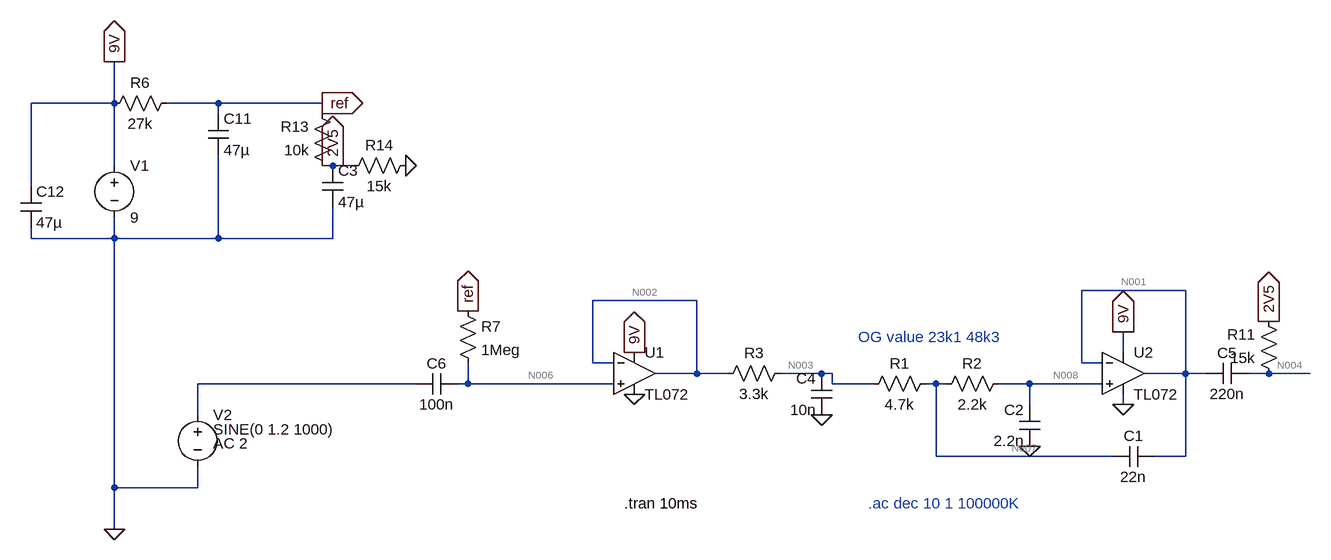
[diagram p0: schematic Butterworth_input_filter_breadboard.asc]
* Butterworth_input_filter_breadboard.asc
V1 9V 0 9
V2 N005 0 SINE(0 1.2 1000) AC 2
R1 N007 N003 4.7k
R2 N008 N007 2.2k
C1 N001 N007 22n
C2 0 N008 2.2n
C6 N006 N005 100n
R7 ref N006 1Meg
* U1: TL072 (symbol TL072 not available, pins judged from their places): In+=N006 In-=N002 V+=9V V-=0 OUT=N002
* U2: TL072 (symbol TL072 not available, pins judged from their places): In+=N008 In-=N001 V+=9V V-=0 OUT=N001
R11 N004 2V5 15k
R6 ref 9V 27k
R13 2V5 ref 10k
R14 2V5 0 15k
C11 ref 0 47µ
C12 9V 0 47µ
C3 2V5 0 47µ
R3 N003 N002 3.3k
C4 0 N003 10n
C5 N001 N004 220n
* .ac dec 10 1 100000K
* OG value 23k1 48k3
.tran 10ms
.backanno
.end

* Results of the author's LTspice run, read from the files saved beside the schematic
* Operating Point, zero values left out:
*   V(9v) = 9 V
*   V(n007) = 4.327 V
*   V(n003) = 4.327 V
*   V(n008) = 4.327 V
*   V(n001) = 4.327 V
*   V(n006) = 4.327 V
*   V(ref) = 4.327 V
*   V(n002) = 4.327 V
*   V(n004) = 2.596 V
*   V(2v5) = 2.596 V
*   I(R1) = -34.38 pA
*   I(R2) = -34.38 pA
*   I(R7) = 34.38 pA
*   I(R6) = -173.1 µA
*   I(R13) = -173.1 µA
*   I(R14) = 173.1 µA
*   I(R3) = -34.38 pA
*   I(V1) = -8.963 mA
*   Ix(u1:1) = 34.38 pA
*   Ix(u1:2) = 34.38 pA
*   Ix(u1:3) = 4.395 mA
*   Ix(u1:4) = -4.395 mA
*   Ix(u1:5) = -68.76 pA
*   Ix(u2:1) = 34.38 pA
*   Ix(u2:2) = 34.38 pA
*   Ix(u2:3) = 4.395 mA
*   Ix(u2:4) = -4.395 mA
*   Ix(u2:5) = -34.38 pA
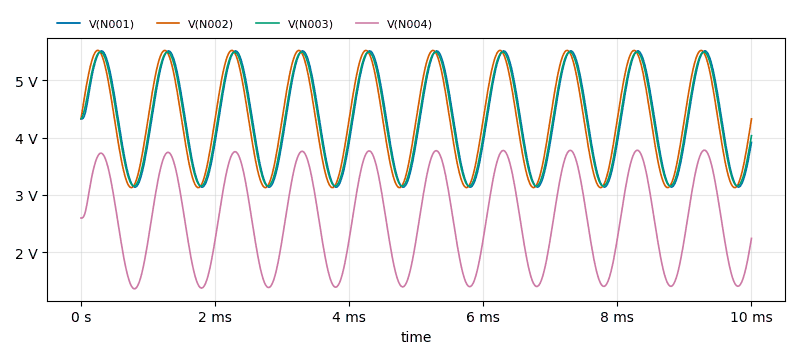
[diagram p1: Transient Analysis of Butterworth_input_filter_breadboard.asc, plotted from the saved traces]
* Transient Analysis, 1 run:
*   V(N001): min 3.135 V, max 5.516 V, average 4.326 V, rms 4.408 V, last 3.919 V
*   V(N002): min 3.126 V, max 5.524 V, average 4.325 V, rms 4.407 V, last 4.327 V
*   V(N003): min 3.153 V, max 5.497 V, average 4.326 V, rms 4.405 V, last 4.034 V
*   V(N004): min 1.36 V, max 3.78 V, average 2.579 V, rms 2.712 V, last 2.242 V